# EAGLE design rotorsteuerung_create (EAGLE 7.3.0)
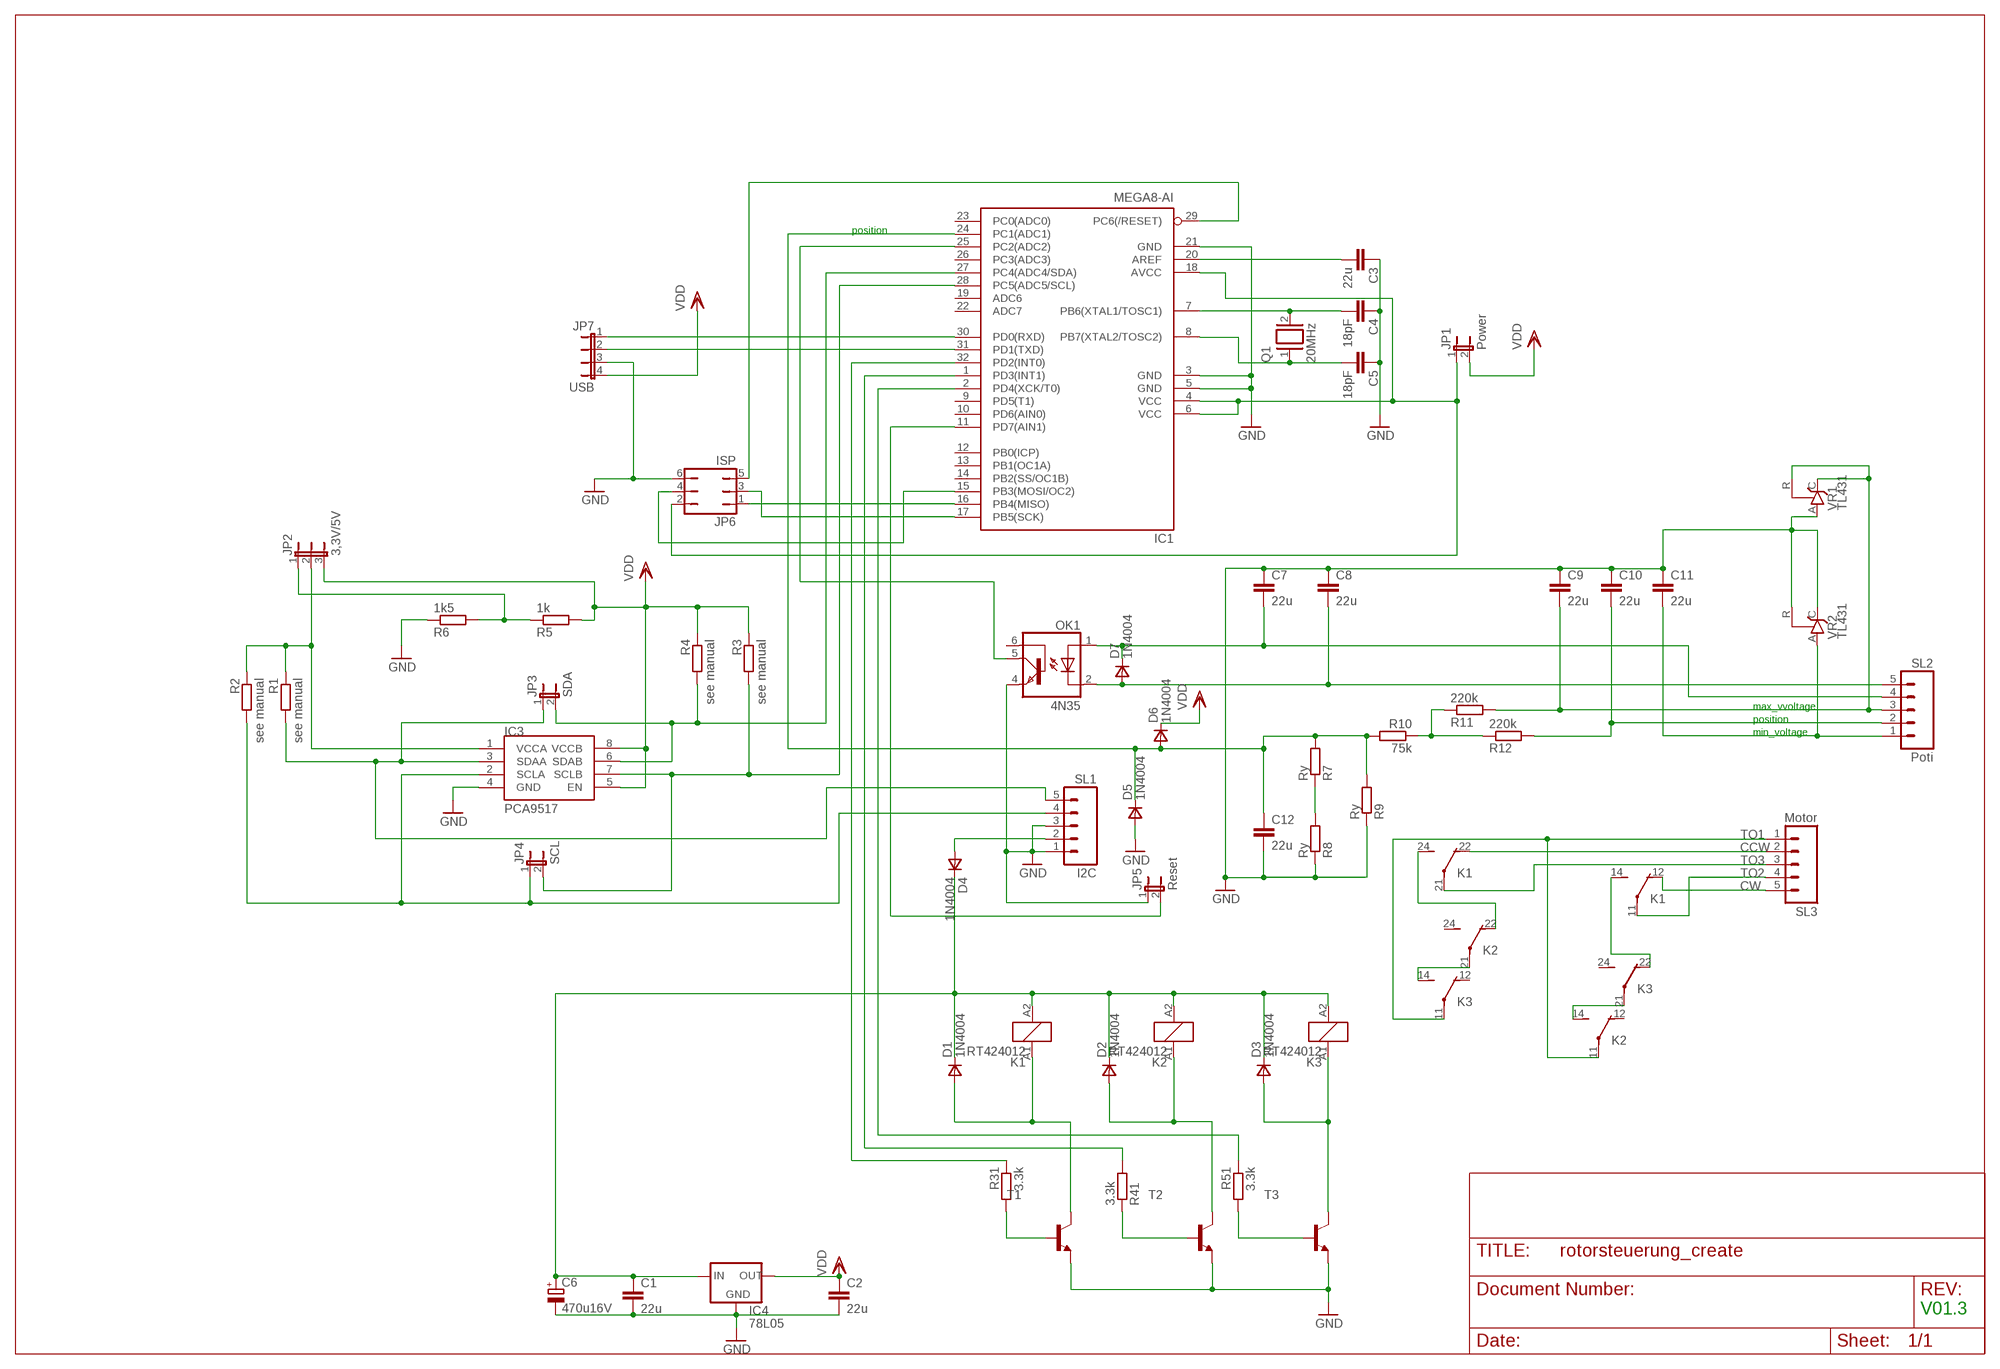
[diagram p0: schematic, sheet 1]

## Parts
C1  22u  C-EUC1206  [C1206]
C2  22u  C-EUC1206  [C1206]
C3  22u  C-EUC1206  [C1206]
C4  18pF  C-EU025-024X044  [C025-024X044]
C5  18pF  C-EU025-024X044  [C025-024X044]
C6  470u16V  CPOL-EUE5-10.5  [E5-10,5]
C7  22u  C-EUC1206  [C1206]
C8  22u  C-EUC1206  [C1206]
C9  22u  C-EUC1206  [C1206]
C10  22u  C-EUC1206  [C1206]
C11  22u  C-EUC1206  [C1206]
C12  22u  C-EUC1206  [C1206]
D1  1N4004  D_E2L  [E2LINE]
D2  1N4004  D_E2L  [E2LINE]
D3  1N4004  D_E2L  [E2LINE]
D4  1N4004  D_E2L  [E2LINE]
D5  1N4004  D_E2L  [E2LINE]
D6  1N4004  D_E2L  [E2LINE]
D7  1N4004  D_E2L  [E2LINE]
IC1  MEGA8-AI  [TQFP32-08]
IC3  PCA9517  [SO-08]
IC4  78L05  78LXX  [78LXX]
JP1  Power  JP1E  [JP1]
JP2  3,3V/5V  JP2E  [JP2]
JP3  SDA  JP1E  [JP1]
JP4  SCL  JP1E  [JP1]
JP5  Reset  JP1E  [JP1]
JP6  ISP  JP3Q  [JP3Q]
JP7  USB  JP4E  [JP4]
K1  RT424012  [RT2C/O]
K2  RT424012  [RT2C/O]
K3  RT424012  [RT2C/O]
OK1  4N35  [DIL06]
Q1  20MHz  XTAL/S  [QS]
R1  see manual  R-EU_M1206  [M1206]
R2  see manual  R-EU_M1206  [M1206]
R3  see manual  R-EU_R1206  [R1206]
R4  see manual  R-EU_R1206  [R1206]
R5  1k  R-EU_R1206  [R1206]
R6  1k5  R-EU_R1206  [R1206]
R7  Ry  R-EU_0204/7  [0204/7]
R8  Ry  R-EU_0204/7  [0204/7]
R9  Ry  R-EU_0204/7  [0204/7]
R10  75k  R-EU_0204/7  [0204/7]
R11  220k  R-EU_0204/7  [0204/7]
R12  220k  R-EU_0204/7  [0204/7]
R31  3.3k  R-EU_R1206  [R1206]
R41  3.3k  R-EU_R1206  [R1206]
R51  3.3k  R-EU_R1206  [R1206]
SL1  I2C  M05  [05P]
SL2  Poti  M05  [05P]
SL3  Motor  M05  [05P]
T1  BC817-16-NPN-SOT23-BEC  [SOT23-BEC]
T2  BC817-16-NPN-SOT23-BEC  [SOT23-BEC]
T3  BC817-16-NPN-SOT23-BEC  [SOT23-BEC]
VR1  TL431  TL431CLP  [TO92-CLP]
VR2  TL431  TL431CLP  [TO92-CLP]

## Nets
C7: C7.2 D7.1(C) OK1.1(A) SL2.4
C9: C9.2 R11.2 SL2.3 VR1.C VR1.R
CCW: K1.22(3:O) SL3.2
CW: K1.12(2:O) SL3.5
GND: C1.2 C2.2 C3.1 C4.1 C5.1 C6.- C7.1 C8.1 C9.1 C10.1 C11.1 C12.2 D5.2(A) IC1.3(GND) IC1.5(GND) IC1.21(GND) IC3.4(GND) IC4.GND JP5.1 JP6.6 JP7.3 OK1.4(EMI) R6.1 R8.1 R9.1 SL1.1 SL1.3 T1.E T2.E T3.E VR1.A VR2.C VR2.R
N$1: IC1.27(PC4(ADC4/SDA)) IC3.6(SDAB) JP3.2 R4.2
N$3: C8.2 D7.2(A) OK1.2(C) SL2.5
N$4: C11.2 SL2.1 VR2.A
N$5: D4.2(A) SL1.2
N$6: K1.24(3:S) K2.22(3:O)
N$7: R7.1 R8.2
N$8: IC1.16(PB4(MISO)) JP6.1
N$9: K1.14(2:S) K3.22(3:O)
N$10: R10.1 R11.1 R12.1
N$11: IC1.4(VCC) IC1.6(VCC) IC1.18(AVCC) JP1.1 JP6.2
N$12: K2.21(3:P) K3.14(2:S)
N$13: R41.1 T2.B
N$15: IC1.2(PD4(XCK/T0)) R51.1
N$16: K2.14(2:S) K3.21(3:P)
N$17: C12.1 D5.1(C) D6.2(A) IC1.24(PC1(ADC1)) R7.2 R9.2 R10.2
N$18: JP2.1 R5.1 R6.2
N$19: C4.2 IC1.7(PB6(XTAL1/TOSC1)) Q1.2
N$20: IC1.17(PB5(SCK)) JP6.3
N$22: IC1.1(PD3(INT1)) R41.2
N$23: IC1.25(PC2(ADC2)) OK1.5(COL)
N$24: IC3.3(SDAA) JP3.1 R1.2 SL1.5
N$25: C1.1 C6.+ D1.1(C) D2.1(C) D3.1(C) D4.1(C) IC4.IN K1.A2 K2.A2 K3.A2
N$26: IC1.11(PD7(AIN1)) JP5.2
N$27: IC3.2(SCLA) JP4.1 R2.2 SL1.4
N$28: C10.2 R12.2 SL2.2
N$29: IC3.1(VCCA) JP2.2 R1.1 R2.1
N$30: IC1.30(PD0(RXD)) JP7.1
N$31: IC1.15(PB3(MOSI/OC2)) JP6.4
N$32: IC1.31(PD1(TXD)) JP7.2
N$33: IC1.32(PD2(INT0)) R31.1
N$34: R31.2 T1.B
N$35: C3.2 IC1.20(AREF)
N$36: R51.2 T3.B
N$37: C5.2 IC1.8(PB7(XTAL2/TOSC2)) Q1.1
N$38: IC1.29(PC6(/RESET)) JP6.5
N$40: D1.2(A) K1.A1 T1.C
N$41: D2.2(A) K2.A1 T2.C
N$42: D3.2(A) K3.A1 T3.C
N$44: IC1.28(PC5(ADC5/SCL)) IC3.7(SCLB) JP4.2 R3.2
TO1: K2.11(2:P) K3.11(2:P) SL3.1
TO2: K1.11(2:P) SL3.4
TO3: K1.21(3:P) SL3.3
VDD: C2.1 D6.1(C) IC3.5(EN) IC3.8(VCCB) IC4.OUT JP1.2 JP2.3 JP7.4 R3.1 R4.1 R5.2
Unconnected: IC1.9(PD5(T1)) IC1.10(PD6(AIN0)) IC1.12(PB0(ICP)) IC1.13(PB1(OC1A)) IC1.14(PB2(SS/OC1B)) IC1.19(ADC6) IC1.22(ADC7) IC1.23(PC0(ADC0)) IC1.26(PC3(ADC3)) K2.12(2:O) K2.24(3:S) K3.12(2:O) K3.24(3:S) OK1.6(BAS)

## Notes on the sheet
- position
- max_vvoltage
- position
- min_voltage
- V01.3

## Library data of the parts
C1-C5 C7-C12 = resistor:C-EU: CAPACITOR, European symbol
C6 = rcl:CPOL-EU: POLARIZED CAPACITOR, European symbol
D1-D7 = zetex:D_E2L: DIODE; OC_FARNELL: unknown; OC_NEWARK: unknown
IC1 = atmel:MEGA8: MICROCONTROLLER 8 Kbytes FLASH, 1 kbytes SRAM, 512 bytes EEPROM, USART, 6-channel 10 bit ADC, 2-channel 8 bit ADC Pin compatible with Atmega48, ATMega88, ATMega168 Source: avr.lbr; MPN: ATMEGA8-16AU; OC_FARNELL: 9171371; OC_NEWARK: 73M8863
IC3 = PCA9517:PCA9517: PCA9517
IC4 = v-reg:78LXX: VOLTAGE REGULATOR
JP1 JP3-JP5 = jumper:JP1E: JUMPER
JP2 = jumper:JP2E: JUMPER
JP6 = jumper:JP3Q: JUMPER
JP7 = jumper:JP4E: JUMPER
K1-K3 = relay:RT42?*: Power PCB Relay SCHRACK 2 pole 8 A, DC and AC-coil Source: http://www.schrack.com/.. 5842.pdf; MPN: RT424012; OC_FARNELL: 1629053; OC_NEWARK: 03P2426
OK1 = optocoupler:4N35: MOTOROLA OPTO COUPLER
Q1 = special:XTAL/S: CRYSTAL
R1-R6 R31 R41 R51 = resistor:R-EU_: RESISTOR, European symbol
R7-R12 = rcl:R-EU_: RESISTOR, European symbol
SL1-SL3 = con-amp-quick:M05: AMP QUICK CONNECTOR; OC_FARNELL: unknown; OC_NEWARK: unknown
T1-T3 = transistor:*-NPN-: NPN Transistror BF959 corrected 2008.03.06
VR1 VR2 = v-reg:TL431CLP: VOLTAGE REGULATOR

## Board
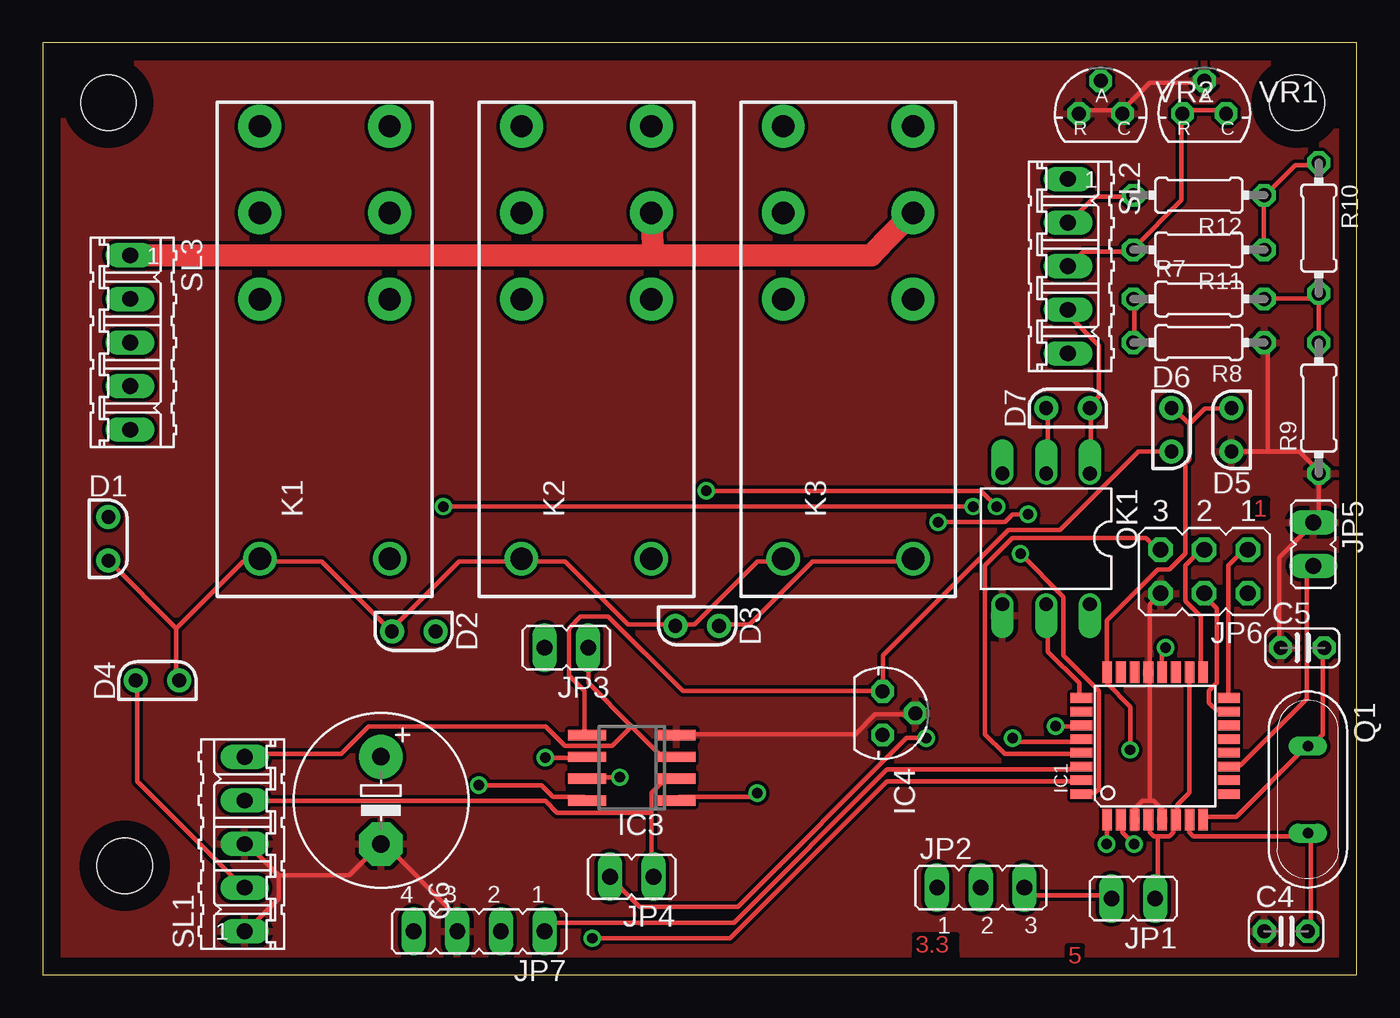
[diagram p1: board, top side]
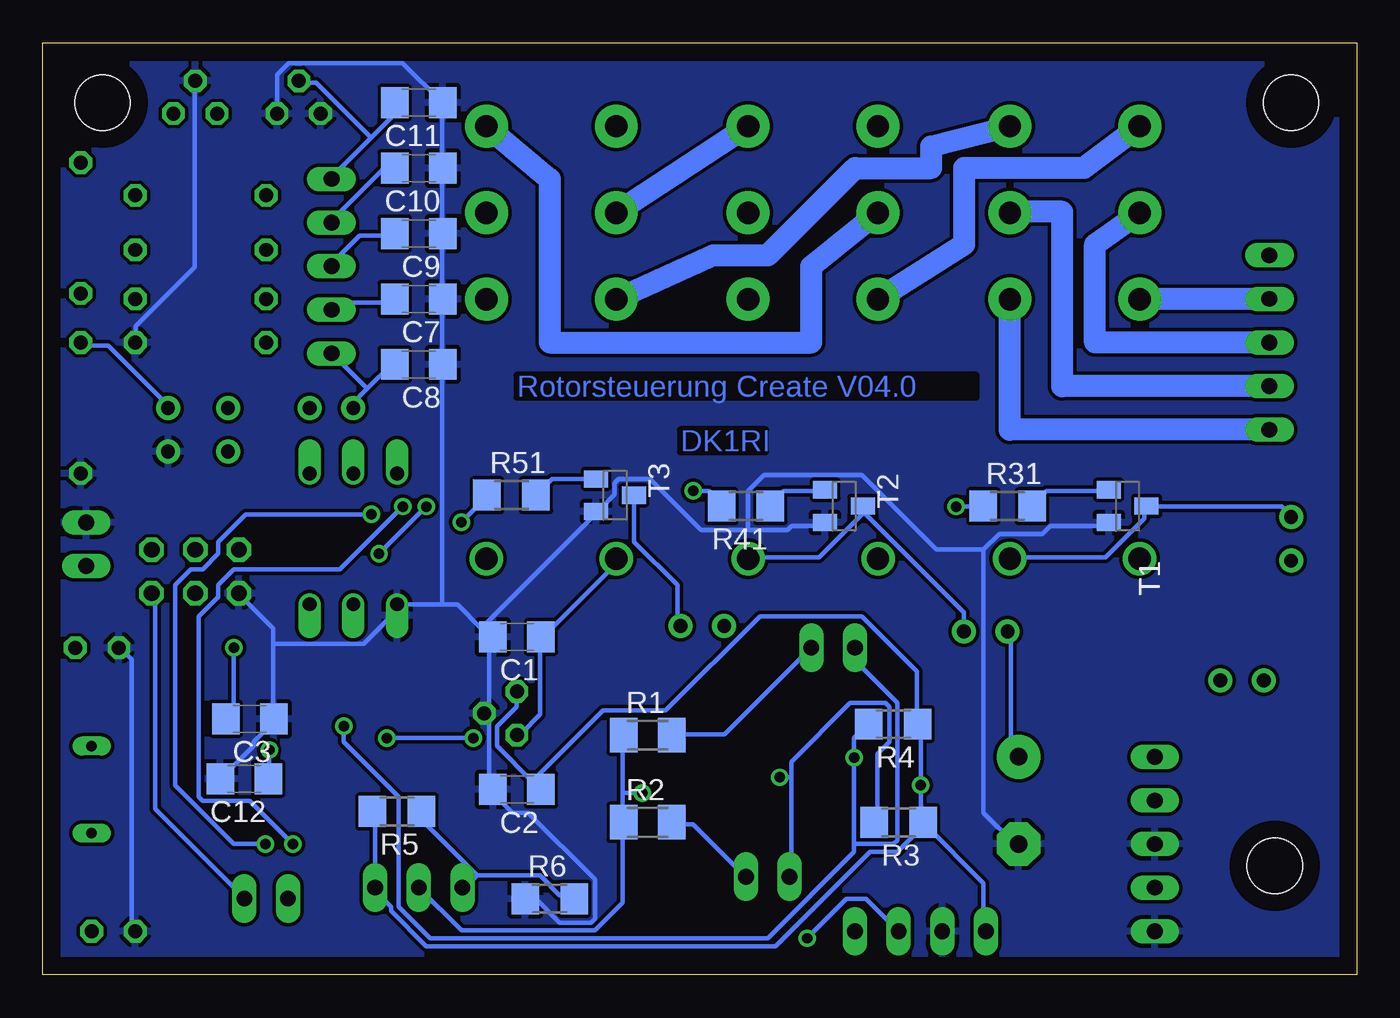
[diagram p2: board, bottom side, seen from below]

Size 76.5 x 54.28 mm. Coordinates in mm from the lower left corner, seen from the top.
Outline: 0,0 76.5,0 76.5,54.28 0,54.28 0,0
Copper layers (1*16): Top 0.035mm / dielectric 1.5mm / Bottom 0.035mm
Design rules "default": minimum track width 10mil, minimum drill 24mil, track to track 8mil, track to pad 8mil, pad to pad 8mil, via to via 8mil, smd to smd 8mil, copper to edge 40mil, drill to drill 8mil, minimum pad ring 10mil, minimum via ring 8mil, stop-mask expansion 4mil, vias tented up to drill 0mil, thermal gap 10mil
Holes 3.2 mm at 73.03,50.8 3.81,50.8 4.76,6.35

### Footprints (pad centres in the part's own frame; a part is rotated, then mirrored left to right if it is on the bottom)
C1206 = smd 1.6 x 1.8: 1 -1.4,0; 2 1.4,0
C025-024X044 = drill 0.813 octagon: 1 -1.27,0; 2 1.27,0
E5-10,5 = drill 1.016 pad 2.54: + -2.54,0 | drill 1.016 pad 2.54 octagon: - 2.54,0
E2LINE = drill 0.8 pad 1.397: 1 0,-1.27; 2 0,1.27
TQFP32-08 = smd 1.27 x 0.559: 1 -4.293,2.8; 2 -4.293,2; 3 -4.293,1.2; 4 -4.293,0.4; 5 -4.293,-0.4; 6 -4.293,-1.2; 7 -4.293,-2; 8 -4.293,-2.8; 17 4.293,-2.8; 18 4.293,-2; 19 4.293,-1.2; 20 4.293,-0.4; 21 4.293,0.4; 22 4.293,1.2; 23 4.293,2; 24 4.293,2.8 | smd 0.559 x 1.27: 9 -2.8,-4.293; 10 -2,-4.293; 11 -1.2,-4.293; 12 -0.4,-4.293; 13 0.4,-4.293; 14 1.2,-4.293; 15 2,-4.293; 16 2.8,-4.293; 25 2.8,4.293; 26 2,4.293; 27 1.2,4.293; 28 0.4,4.293; 29 -0.4,4.293; 30 -1.2,4.293; 31 -2,4.293; 32 -2.8,4.293
SO-08 = smd 0.6 x 2.2: 1 -1.905,-2.6; 2 -0.635,-2.6; 3 0.635,-2.6; 4 1.905,-2.6; 5 1.905,2.6; 6 0.635,2.6; 7 -0.635,2.6; 8 -1.905,2.6
78LXX = drill 0.813 octagon: GND 0,1.905; IN 1.27,0; OUT -1.27,0
JP1 = drill 0.914 long: 1 0,-1.27; 2 0,1.27
JP2 = drill 0.914 long: 1 -2.54,0; 2 0,0; 3 2.54,0
JP3Q = drill 0.914 octagon: 1 -2.54,-1.27; 2 -2.54,1.27; 3 0,-1.27; 4 0,1.27; 5 2.54,-1.27; 6 2.54,1.27
JP4 = drill 0.914 long: 1 -3.81,0; 2 -1.27,0; 3 1.27,0; 4 3.81,0
RT2C/O = drill 1.3 pad 2.5: 11 7.56,-3.68; 12 2.52,-3.68; 14 12.6,-3.68; 21 7.56,3.88; 22 2.52,3.88; 24 12.6,3.88 | drill 1.3: A1 -12.6,-3.68; A2 -12.6,3.88
DIL06 = drill 0.813 offset: 1 -2.54,-3.81; 2 0,-3.81; 3 2.54,-3.81; 4 2.54,3.81; 5 0,3.81; 6 -2.54,3.81
QS = drill 0.61 long: 1 -2.54,0; 2 2.54,0
M1206 = smd 1.6 x 2: 1 -1.4,0; 2 1.4,0
R1206 = smd 1.6 x 1.803: 1 -1.422,0; 2 1.422,0
0204/7 = drill 0.813 octagon: 1 -3.81,0; 2 3.81,0
05P = drill 0.914 long: 1 -5.08,0; 2 -2.54,0; 3 0,0; 4 2.54,0; 5 5.08,0
SOT23-BEC = smd 1 x 1.4: B -0.95,-1.1; C 0,1.1; E 0.95,-1.1
TO92-CLP = drill 0.813 octagon: A 0,1.905; C 1.27,0; R -1.27,0

### Placement (x,y rotation side)
C1  48.9,19.68 180 bottom
C2  48.9,10.8 180 bottom
C3  64.45,14.92 180 bottom
C4  72.39,2.54 0 top
C5  73.34,19.05 0 top
C6  19.68,10.16 270 top
C7  54.61,39.37 180 bottom
C8  54.61,35.56 180 bottom
C9  54.61,43.18 180 bottom
C10  54.61,46.99 180 bottom
C11  54.61,50.8 180 bottom
C12  64.77,11.43 180 bottom
D1  3.81,25.4 0 top
D2  21.59,20 270 top
D3  38.1,20.32 270 top
D4  6.67,17.14 90 top
D5  69.22,31.75 180 top
D6  65.72,31.75 0 top
D7  59.69,33.02 90 top
IC1  64.77,13.34 90 top
IC3  34.29,12.06 90 top
IC4  48.9,15.24 270 top
JP1  63.5,4.44 90 top
JP2  54.61,5.08 0 top
JP3  30.48,19.05 90 top
JP4  34.29,5.71 90 top
JP5  73.98,25.08 180 top
JP6  67.63,23.49 180 top
JP7  25.4,2.54 180 top
K1  16.51,36.83 90 top
K2  31.75,36.83 90 top
K3  46.99,36.83 90 top
OK1  58.42,25.4 180 top
Q1  73.66,10.8 270 top
R1  41.27,13.97 0 bottom
R2  41.27,8.89 0 bottom
R3  26.67,8.89 180 bottom
R4  26.99,14.6 180 bottom
R5  55.88,9.52 180 bottom
R6  46.99,4.44 0 bottom
R7  67.31,39.37 0 top
R8  67.31,36.83 180 top
R9  74.3,33.02 90 top
R10  74.3,43.5 270 top
R11  67.31,42.23 180 top
R12  67.31,45.41 180 top
R31  20.32,27.3 0 bottom
R41  35.56,27.3 180 bottom
R51  49.21,27.94 0 bottom
SL1  11.75,7.62 90 top
SL2  59.69,41.27 270 top
SL3  5.08,36.83 270 top
T1  13.34,27.3 270 bottom
T2  29.84,27.3 270 bottom
T3  43.18,27.94 270 bottom
VR1  67.63,50.16 0 top
VR2  61.59,50.16 0 top

### Tracks (layer width: path | path; a pad name or v marks a point on that pad's centre or on a via)
C7
  Top 0.254: OK1.1 61.04,29.34 61.04,32.99 D7.1 61.04,33.22 61.49,33.68 61.49,36.65 59.89,38.25 59.89,38.71 SL2.4
  Bottom 0.254: C7.2 56.24,39.17 59.44,39.17 59.66,38.94 SL2.4
C9
  Top 0.254: VR1.C 68.81,50.37 66.52,50.37 VR1.R 66.29,50.14 66.29,45.11 63.55,42.37 R11.2 63.32,42.14 60.58,42.14 59.89,41.45 SL2.3
  Bottom 0.254: C9.2 56.24,43.05 58.06,43.05 59.66,41.45 SL2.3
CCW
  Bottom 1.27: SL3.2 K1.22
CW
  Bottom 1.27: SL3.5 20.19,31.75 K1.12
GND
  Top 0.254: 62.87,50.37 60.35,50.37 VR2.R | 62.87,50.37 64.47,51.97 67.44,51.97 VR1.A | 62.87,50.37 VR2.C | 71.32,30.48 73.15,30.48 74.3,29.34 R9.1 74.3,26.59 74.07,26.36 JP5.1 73.84,26.14 72.01,24.31 72.01,19.05 C5.1 | 71.32,30.48 D5.2 | 71.32,30.48 71.32,36.65 R8.1 | 13.72,5.79 13.72,4.42 11.89,2.59 SL1.1 | 13.72,5.79 11.89,7.62 SL1.3 | JP7.3 24,2.59 24,3.5 19.89,7.62 C6.- 19.66,7.62 17.83,5.79 13.72,5.79 | 64.47,10.13 64.69,10.13 65.15,9.68 65.15,9.22 IC1.5 | 64.47,10.13 64.01,10.13 63.55,9.68 63.55,9.22 IC1.3 | JP6.6 64.92,22.02 64.47,21.56 64.47,17.68 IC1.21 64.47,17.45 64.47,10.13 | IC3.4 37.03,14.02 47.32,14.02 48.46,15.16 50.75,15.16 IC4.GND
  Bottom 0.254: VR2.C 62.87,52.43 62.18,53.11 55.55,53.11 53.26,50.83 C11.1 53.26,50.6 53.26,47.17 C10.1 53.26,46.94 53.26,43.28 C9.1 53.26,43.05 53.26,39.39 C7.1 53.26,39.17 53.26,35.74 C8.1 53.26,35.51 53.26,21.56 | R8.1 71.09,36.88 71.09,37.8 67.67,41.22 67.67,51.97 VR1.A | C4.1 71.32,2.59 71.32,18.36 72.01,19.05 C5.1 | 21.72,24.77 20.8,25.68 18.29,25.68 17.83,26.14 14.63,26.14 T1.E | 21.72,24.77 21.72,9.45 19.89,7.62 C6.- | C12.2 66.06,11.51 64.24,13.34 64.24,13.56 63.09,14.71 C3.1 63.09,14.93 63.09,19.28 | 63.09,19.28 63.09,20.19 64.92,22.02 JP6.6 | 35.43,25.91 38.18,25.91 41.15,28.88 42.98,28.88 43.2,28.65 43.2,27.96 44.12,27.05 T3.E 44.35,26.82 50.98,20.19 | 35.43,25.91 33.15,25.91 32.92,26.14 31.09,26.14 T2.E | C1.2 50.52,19.51 50.52,15.62 50.75,15.39 IC4.GND 50.75,15.16 50.52,14.93 50.52,10.82 C2.2 50.29,10.59 49.15,9.45 48.23,9.45 44.35,5.56 44.35,3.28 44.58,3.05 46.41,3.05 47.78,4.42 48.23,4.42 R6.1 | 53.26,21.56 52.35,21.56 50.98,20.19 | 53.26,21.56 55.55,21.56 | 55.55,21.56 55.78,21.56 OK1.4 55.55,21.56 | 50.98,20.19 50.52,19.74 C1.2 | 50.98,20.19 C1.2 | 63.09,19.28 57.84,19.28 55.55,21.56 | 21.72,24.77 24.46,24.77 28.8,29.11 34.52,29.11 35.43,28.19 35.43,25.91
  pour Top: 0.64,53.34 75.56,53.34 75.56,0.63 0.64,0.63
  pour Bottom: 0.64,53.34 75.56,53.34 75.56,0.63 0.64,0.63
N$1  (via drill 0.61)
  Top 0.254: v58.98,14.48 60.35,14.48 IC1.27 | v29.26,12.65 31.55,12.65 IC3.6
  Bottom 0.254: v58.98,14.48 58.98,13.56 55.78,10.36 55.78,3.96 53.95,2.13 34.29,2.13 29.26,7.16 29.26,7.62 | 29.26,7.62 v29.26,12.65 29.26,13.79 28.57,14.48 R4.2 | 29.26,7.62 26.98,7.62 26.75,7.85 26.75,15.85 29.03,18.14 29.03,19.05 JP3.2
N$3
  Top 0.254: OK1.2 58.52,29.34 58.52,32.99 D7.2
  Bottom 0.254: 57.61,34.14 58.52,33.22 D7.2 | 57.61,34.14 56.24,35.51 C8.2 | 57.61,34.14 59.66,36.2 SL2.5
N$4
  Bottom 0.254: 57.38,48.77 59.66,46.48 SL2.1 | 57.38,48.77 56.24,49.91 56.24,50.6 C11.2 | 57.38,48.77 60.58,51.97 61.49,51.97 VR2.A
N$5
  Top 0.254: D4.2 5.49,16.99 5.49,11.28 11.66,5.1 SL1.2
N$6
  Bottom 1.27: K1.24 15.88,46.99 22.86,46.99 22.86,42.55 K2.22
N$7
  Top 0.254: R8.2 63.55,36.88 63.55,39.17 R7.1
N$8
  Top 0.254: IC1.16 69.04,16.31 69.04,23.85 69.95,24.77 JP6.1
N$9
  Bottom 1.27: K3.22 37.47,41.91 34.29,41.91 29.21,46.99 24.77,46.99 24.77,48.26 K1.14
N$10
  Top 0.254: R11.1 71.09,42.37 71.09,45.34 R12.1 71.32,45.57 72.92,47.17 74.3,47.17 R10.1
N$11
  Top 0.254: 64.92,8.08 65.61,8.08 65.84,8.31 65.84,8.99 IC1.6 66.06,9.22 66.06,9.91 66.75,10.59 66.75,17.45 IC1.18 | 64.92,8.08 64.69,8.08 64.47,8.31 64.47,8.99 IC1.4 | 64.92,8.08 64.92,4.65 JP1.1
  Bottom 0.254: JP6.2 69.95,22.02 69.95,9.68 64.92,4.65 JP1.1
N$12
  Bottom 1.27: K3.14 46.99,46.36 46.99,36.83 31.75,36.83 31.75,41.27 K2.21
N$13
  Bottom 0.254: T2.B 31.09,28.19 33.38,28.19 34.06,27.51 R41.1
N$15  (via drill 0.61)
  Top 0.254: v63.55,7.62 62.87,8.31 62.87,8.99 IC1.2 | v57.38,26.82 56.46,26.82 56.01,26.36 v52.12,26.36
  Bottom 0.254: v63.55,7.62 65.38,7.62 68.81,11.05 68.81,22.71 67.89,23.62 67.21,23.62 66.29,24.54 66.29,25.22 64.69,26.82 v57.38,26.82 | v52.12,26.36 50.75,27.74 R51.1
N$16
  Bottom 1.27: K3.21 K2.14
N$17  (via drill 0.61)
  Top 0.254: 74.3,39.62 74.07,39.39 71.32,39.39 R7.2 | 74.3,39.62 R9.2 | 74.3,39.62 R10.2 | 66.75,32.08 66.75,30.02 66.52,29.79 66.52,24.54 65.61,23.62 64.92,23.62 61.95,20.65 61.95,17.68 IC1.24 61.95,17.45 61.95,16.99 63.32,15.62 v63.32,13.11 | 66.75,32.08 65.84,32.99 D6.2 | 66.75,32.08 67.67,32.99 69.04,32.99 D5.1
  Bottom 0.254: v63.32,13.11 63.32,11.51 C12.1 | R9.2 74.3,36.65 72.69,36.65 69.27,33.22 D5.1
N$18
  Bottom 0.254: 51.21,5.79 47.55,5.79 46.41,4.65 45.72,4.65 R6.2 | 51.21,5.79 51.89,5.1 JP2.1 | 51.21,5.79 54.41,8.99 54.41,9.45 R5.1
N$19
  Top 0.254: IC1.7 66.75,8.99 66.75,8.31 66.98,8.08 73.61,8.08 Q1.2 73.84,8.08 73.84,2.59 C4.2
N$20
  Top 0.254: IC1.17 67.44,17.68 67.44,20.88 66.52,21.79 66.52,23.85 67.44,24.77 JP6.3
N$22  (via drill 0.61)
  Top 0.254: v61.95,7.62 61.95,8.99 IC1.1 | v55.55,27.28 54.63,28.19 v38.63,28.19
  Bottom 0.254: v61.95,7.62 64.47,10.13 67.21,10.13 67.44,10.36 67.44,20.88 66.29,22.02 66.29,22.71 65.38,23.62 59.21,23.62 v55.55,27.28 | v38.63,28.19 37.72,28.19 37.03,27.51 R41.2
N$23
  Top 0.254: IC1.25 60.35,16.31 60.35,16.99 58.52,18.82 58.52,21.56 OK1.5
N$24
  Top 0.254: 34.29,14.48 31.77,16.99 31.77,19.05 JP3.1 | 34.29,14.48 35.89,12.88 36.8,12.88 IC3.3 | 34.29,14.48 33.15,13.34 30.4,13.34 29.26,14.48 18.97,14.48 17.37,12.88 11.89,12.88 SL1.5
  Bottom 0.254: R1.2 39.78,14.02 36.8,14.02 31.77,19.05 JP3.1
N$25
  Top 0.254: K3.A2 42.98,24.08 41.6,24.08 37.95,20.42 37.03,20.42 D3.1 36.8,20.42 34.06,20.42 30.4,24.08 27.89,24.08 K2.A2 27.66,24.08 24.23,24.08 20.34,20.19 D2.1 20.12,20.19 16.23,24.08 12.8,24.08 K1.A2 12.57,24.08 11.66,24.08 7.77,20.19 | 7.77,20.19 7.77,17.22 D4.1 | 7.77,20.19 3.89,24.08 D1.1
  Bottom 0.254: IC4.IN 48.69,14.02 47.55,15.16 47.55,19.51 C1.1 47.32,19.74 42.98,24.08 K3.A2 | D2.1 20.12,19.96 20.12,13.11 19.89,12.88 C6.+
N$26
  Top 0.254: IC1.11 69.27,12.19 69.72,12.19 73.61,16.08 73.61,23.39 73.84,23.62 JP5.2
N$27
  Top 0.254: 35.43,9.45 35.43,5.79 JP4.1 | 35.43,9.45 35.43,10.59 36.12,11.28 36.8,11.28 IC3.2 | 35.43,9.45 29.95,9.45 29.26,10.13 11.89,10.13 SL1.4
  Bottom 0.254: R2.2 39.78,8.76 38.63,8.76 35.66,5.79 JP4.1
N$28
  Top 0.254: R12.2 63.32,45.34 61.27,45.34 59.89,43.97 SL2.2
  Bottom 0.254: C10.2 56.24,46.94 56.69,46.94 59.66,43.97 SL2.2
N$29  (via drill 0.61)
  Top 0.254: v41.6,10.59 41.38,10.36 37.03,10.36 IC3.1
  Bottom 0.254: 42.75,10.59 42.75,13.79 R1.1 | 42.75,10.59 42.75,8.99 R2.1 42.75,8.76 42.75,4.19 44.35,2.59 52.12,2.59 JP2.2 | 42.75,10.59 v41.6,10.59
N$30
  Top 0.254: JP7.1 29.72,3.05 40.23,3.05 49.15,11.96 60.35,11.96 IC1.30
N$31
  Top 0.254: IC1.15 69.04,15.39 68.35,15.39 67.89,15.85 67.89,16.53 68.35,16.99 68.35,21.34 67.67,22.02 JP6.4
N$32  (via drill 0.61)
  Top 0.254: v32,2.13 40.01,2.13 49.15,11.28 60.35,11.28 IC1.31
  Bottom 0.254: v32,2.13 29.72,4.42 28.57,4.42 26.75,2.59 JP7.2
N$33  (via drill 0.61)
  Top 0.254: v56.92,24.54 59.44,22.02 59.44,18.59 61.49,16.53 61.49,10.82 61.27,10.59 60.58,10.59 IC1.32 | v23.32,27.28 v54.18,27.28
  Bottom 0.254: v54.18,27.28 v56.92,24.54 | v23.32,27.28 21.95,27.28 R31.1
N$34
  Bottom 0.254: T1.B 14.63,28.19 18.06,28.19 18.75,27.51 R31.2
N$35  (via drill 0.61)
  Top 0.254: v65.38,19.05 65.15,18.82 65.15,17.68 IC1.20
  Bottom 0.254: v65.38,19.05 65.38,15.39 65.84,14.93 C3.2
N$36
  Bottom 0.254: T3.B 44.35,28.88 46.86,28.88 47.78,27.96 R51.2
N$37
  Top 0.254: IC1.8 67.67,9.22 69.49,9.22 73.61,13.34 Q1.1 73.84,13.34 74.52,14.02 74.52,19.05 C5.2
N$38
  Top 0.254: IC1.29 60.35,12.88 56.01,12.88 54.86,14.02 54.86,23.85 56.46,25.45 64.24,25.45 64.92,24.77 JP6.5
N$40
  Bottom 0.254: D1.2 3.89,26.82 4.34,27.28 12.12,27.28 T1.C 12.34,27.28 12.34,26.59 14.63,24.31 20.12,24.31 K1.A1
N$41
  Bottom 0.254: 28.8,27.05 28.8,26.82 31.32,24.31 35.2,24.31 K2.A1 | 28.8,27.05 28.8,27.28 T2.C 28.8,27.05 | D2.2 22.86,21.11 28.8,27.05
N$42
  Top 0.254: K3.A1 50.52,24.08 44.81,24.08 41.15,20.42 39.55,20.42 D3.2
  Bottom 0.254: T3.C 42.06,27.74 42.06,25.22 39.55,22.71 39.55,20.42 D3.2
N$44  (via drill 0.61)
  Top 0.254: v56.46,13.79 56.69,13.56 60.35,13.56 IC1.28 | v51.44,13.79 50.29,13.79 40.46,3.96 34.75,3.96 33.15,5.56 JP4.2 | v33.6,11.51 31.77,11.51 IC3.7
  Bottom 0.254: v51.44,13.79 v56.46,13.79 | 32.92,11.51 32.92,5.79 JP4.2 | 32.92,11.51 32.92,12.42 29.49,15.85 27.43,15.85 27.2,15.62 27.2,13.56 27.89,12.88 27.89,8.99 R3.2 | 32.92,11.51 v33.6,11.51
TO1
  Top 1.27: SL3.1 35.56,41.91 | 35.56,41.91 K2.11 | 35.56,41.91 48.26,41.91 K3.11
TO2
  Bottom 0.406: 20.19,44.45 K1.11
  Bottom 1.27: SL3.4 17.14,34.29 17.14,44.45 20.19,44.45
TO3
  Bottom 1.27: SL3.3 15.24,36.83 15.24,42.55 K1.21
VDD  (via drill 0.61)
  Top 0.254: JP1.2 62.18,4.65 57.38,4.65 57.15,4.88 JP2.3 | v25.38,11.05 29.03,11.05 29.72,10.36 31.55,10.36 IC3.8 | IC3.5 31.55,14.02 31.55,16.53 30.63,17.45 30.63,20.19 31.32,20.88 32.92,20.88 37.26,16.53 48.69,16.53 IC4.OUT 48.92,16.53 48.92,18.59 56.24,25.91 59.21,25.91 63.78,30.48 D6.1
  Bottom 0.254: R5.2 57.15,9.45 JP2.3 57.15,4.88 56.24,3.96 56.24,3.73 54.18,1.68 33.83,1.68 28.35,7.16 26.75,7.16 25.15,8.76 | 25.15,8.76 21.72,5.33 21.72,2.59 JP7.4 | 25.15,8.76 R3.1 25.38,8.99 v25.38,11.05 25.38,14.48 R4.1 25.6,14.71 25.6,17.68 28.8,20.88 34.75,20.88 40.23,15.39 43.89,15.39 48.01,11.28 | 48.01,11.28 50.06,13.34 50.06,14.48 48.92,15.62 48.92,16.31 IC4.OUT | 48.01,11.28 47.55,10.82 C2.1 48.01,11.28

### Text on the board
Top: 1 | 3.3 | 5
Bottom: Rotorsteuerung Create V04.0 | DK1RI